# EAGLE design pCog104_Tester (EAGLE 6.6.0)

## Sheet 1 of 3
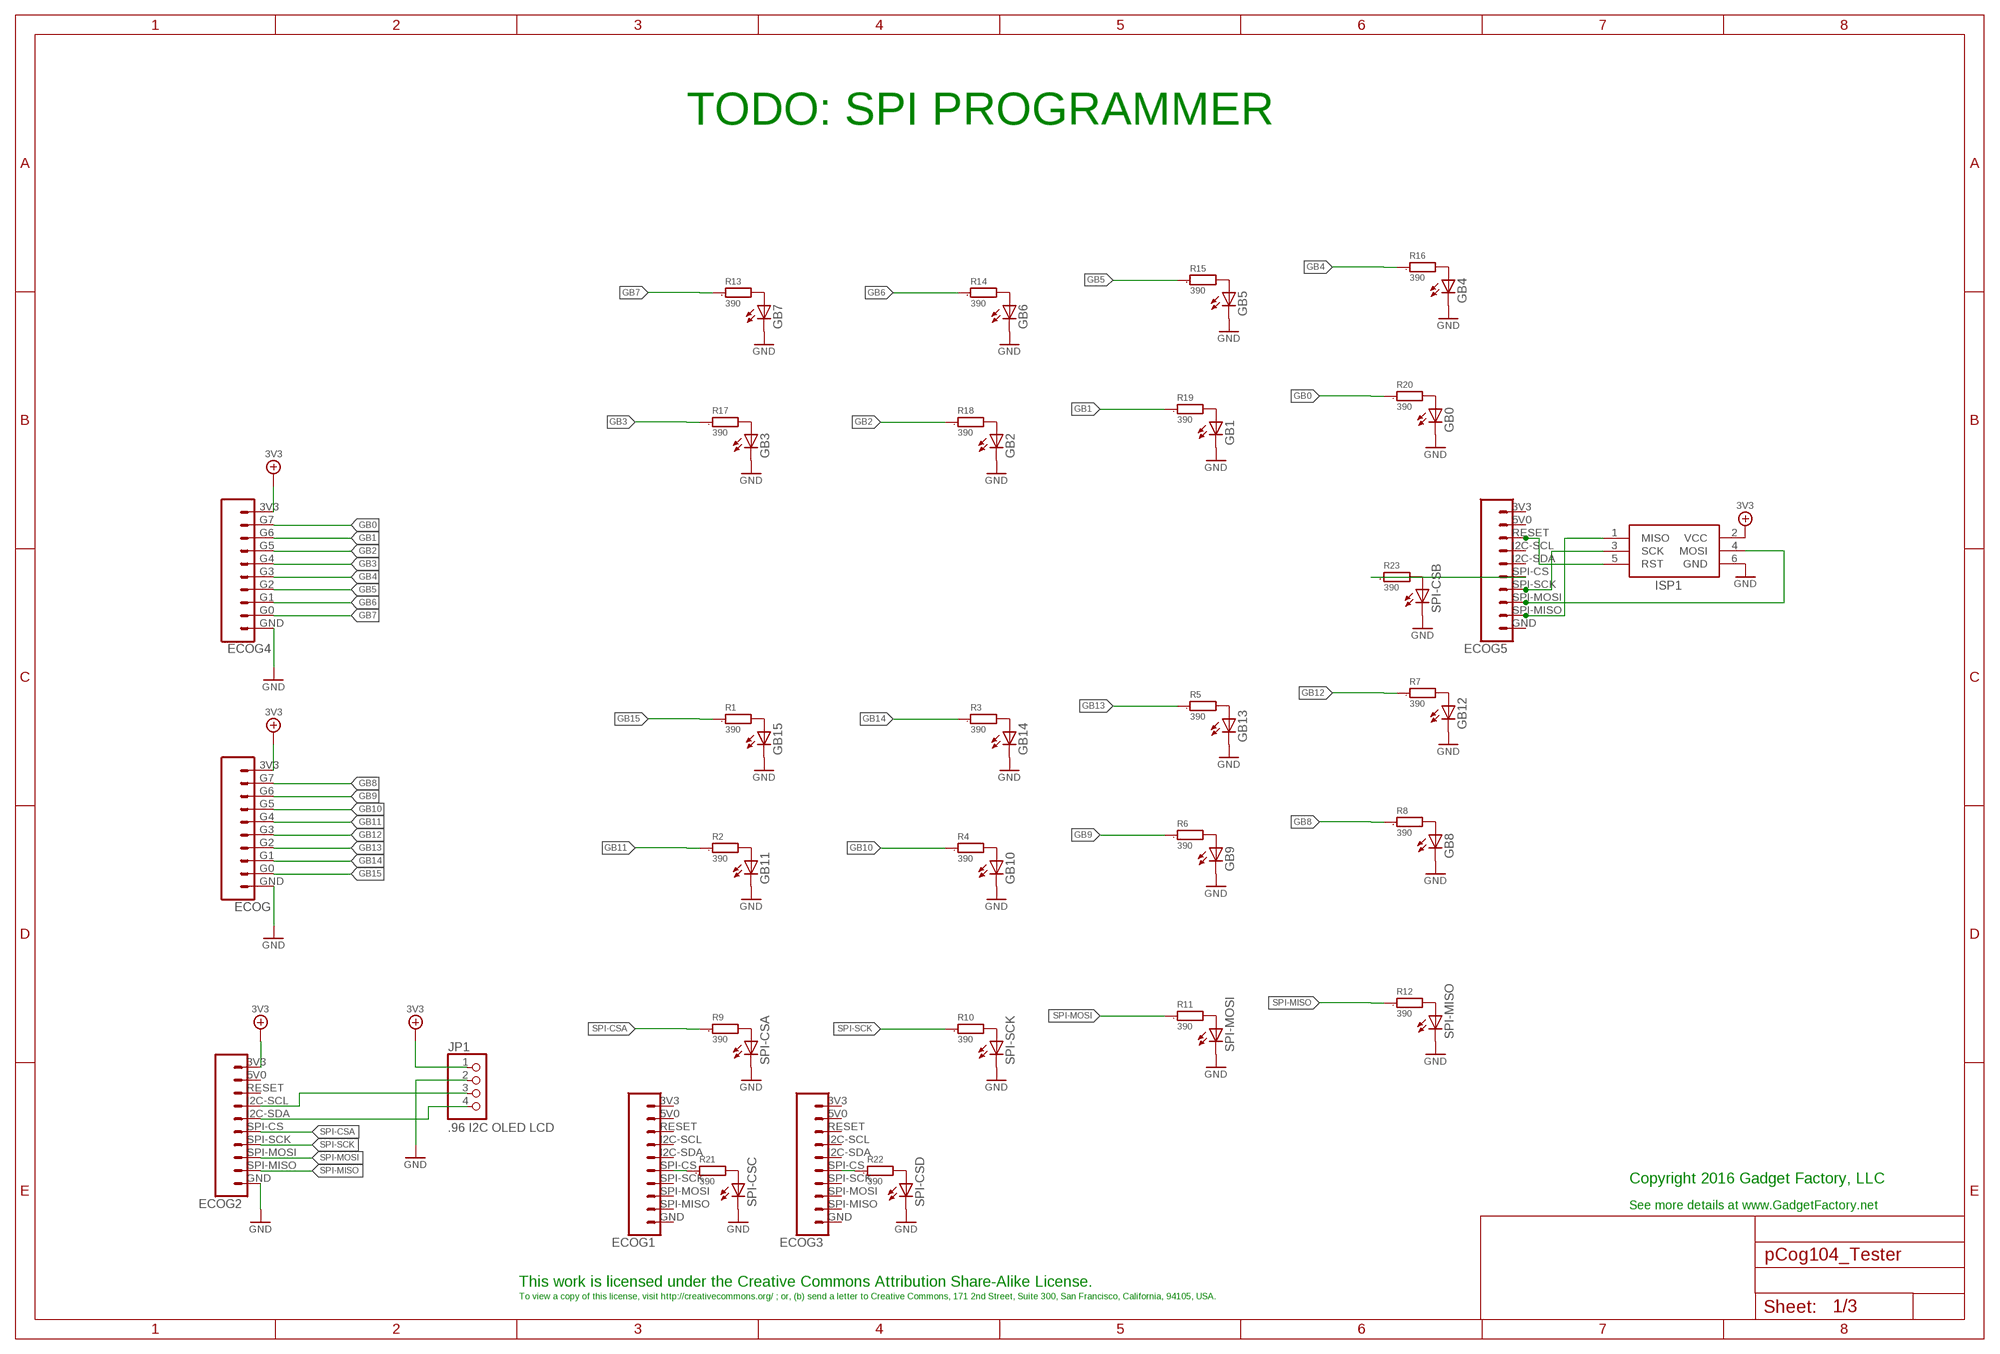
[diagram p0: schematic, sheet 1]

### Parts
ECOG  ECOG_GENERAL_ROWTHROUGHOLE  [ECOG_GENERAL_TH]
ECOG1  ECOG_BUSES_ROWTHROUGHHOLE  [ECOG_BUSES_TH]
ECOG2  ECOG_BUSES_ROWTHROUGHHOLE  [ECOG_BUSES_TH]
ECOG3  ECOG_BUSES_ROWTHROUGHHOLE  [ECOG_BUSES_TH]
ECOG4  ECOG_GENERAL_ROWTHROUGHOLE  [ECOG_GENERAL_TH]
ECOG5  ECOG_BUSES_ROWTHROUGHHOLE  [ECOG_BUSES_TH]
GB0  LEDCHIP-LED0805  [CHIP-LED0805]
GB1  LEDCHIP-LED0805  [CHIP-LED0805]
GB2  LEDCHIP-LED0805  [CHIP-LED0805]
GB3  LEDCHIP-LED0805  [CHIP-LED0805]
GB4  LEDCHIP-LED0805  [CHIP-LED0805]
GB5  LEDCHIP-LED0805  [CHIP-LED0805]
GB6  LEDCHIP-LED0805  [CHIP-LED0805]
GB7  LEDCHIP-LED0805  [CHIP-LED0805]
GB8  LEDCHIP-LED0805  [CHIP-LED0805]
GB9  LEDCHIP-LED0805  [CHIP-LED0805]
GB10  LEDCHIP-LED0805  [CHIP-LED0805]
GB11  LEDCHIP-LED0805  [CHIP-LED0805]
GB12  LEDCHIP-LED0805  [CHIP-LED0805]
GB13  LEDCHIP-LED0805  [CHIP-LED0805]
GB14  LEDCHIP-LED0805  [CHIP-LED0805]
GB15  LEDCHIP-LED0805  [CHIP-LED0805]
ISP1  AVRISP-6  [AVRISP]
JP1  .96 I2C OLED LCD  PINHD-1X4  [1X04]
R1  390  R0805  [0805]
R2  390  R0805  [0805]
R3  390  R0805  [0805]
R4  390  R0805  [0805]
R5  390  R0805  [0805]
R6  390  R0805  [0805]
R7  390  R0805  [0805]
R8  390  R0805  [0805]
R9  390  R0805  [0805]
R10  390  R0805  [0805]
R11  390  R0805  [0805]
R12  390  R0805  [0805]
R13  390  R0805  [0805]
R14  390  R0805  [0805]
R15  390  R0805  [0805]
R16  390  R0805  [0805]
R17  390  R0805  [0805]
R18  390  R0805  [0805]
R19  390  R0805  [0805]
R20  390  R0805  [0805]
R21  390  R0805  [0805]
R22  390  R0805  [0805]
R23  390  R0805  [0805]
SPI-CSA  LEDCHIP-LED0805  [CHIP-LED0805]
SPI-CSB  LEDCHIP-LED0805  [CHIP-LED0805]
SPI-CSC  LEDCHIP-LED0805  [CHIP-LED0805]
SPI-CSD  LEDCHIP-LED0805  [CHIP-LED0805]
SPI-MISO  LEDCHIP-LED0805  [CHIP-LED0805]
SPI-MOSI  LEDCHIP-LED0805  [CHIP-LED0805]
SPI-SCK  LEDCHIP-LED0805  [CHIP-LED0805]

### Nets
3V3: ECOG2.3V3 ECOG4.3V3 ECOG.3V3 ISP1.2(VCC) JP1.1
GB0: ECOG4.G7 R20.1
GB1: ECOG4.G6 R19.1
GB2: ECOG4.G5 R18.1
GB3: ECOG4.G4 R17.1
GB4: ECOG4.G3 R16.1
GB5: ECOG4.G2 R15.1
GB6: ECOG4.G1 R14.1
GB7: ECOG4.G0 R13.1
GB8: ECOG.G7 R8.1
GB9: ECOG.G6 R6.1
GB10: ECOG.G5 R4.1
GB11: ECOG.G4 R2.1
GB12: ECOG.G3 R7.1
GB13: ECOG.G2 R5.1
GB14: ECOG.G1 R3.1
GB15: ECOG.G0 R1.1
GND: ECOG2.GND ECOG4.GND ECOG.GND GB0.C GB1.C GB2.C GB3.C GB4.C GB5.C GB6.C GB7.C GB8.C GB9.C GB10.C GB11.C GB12.C GB13.C GB14.C GB15.C ISP1.6(GND) JP1.2 SPI-CSA.C SPI-CSB.C SPI-CSC.C SPI-CSD.C SPI-MISO.C SPI-MOSI.C SPI-SCK.C
N$1: GB15.A R1.2
N$2: GB14.A R3.2
N$3: GB13.A R5.2
N$4: GB12.A R7.2
N$5: R9.2 SPI-CSA.A
N$6: R10.2 SPI-SCK.A
N$7: ECOG2.I2C-SDA JP1.4
N$8: ECOG2.I2C-SCL JP1.3
N$9: R11.2 SPI-MOSI.A
N$10: R12.2 SPI-MISO.A
N$11: R21.2 SPI-CSC.A
N$12: GB11.A R2.2
N$13: GB10.A R4.2
N$14: GB9.A R6.2
N$15: GB8.A R8.2
N$16: GB7.A R13.2
N$17: GB6.A R14.2
N$18: GB5.A R15.2
N$19: GB4.A R16.2
N$20: GB3.A R17.2
N$21: GB2.A R18.2
N$22: GB1.A R19.2
N$23: GB0.A R20.2
N$24: R22.2 SPI-CSD.A
N$25: R23.2 SPI-CSB.A
N$26: ECOG1.SPI-CS R21.1
N$27: ECOG3.SPI-CS R22.1
N$28: ECOG5.SPI-CS R23.1
N$29: ECOG5.SPI-MISO ISP1.1(MISO)
N$30: ECOG5.SPI-SCK ISP1.3(SCK)
N$31: ECOG5.RESET(RSV) ISP1.5(RST)
N$32: ECOG5.SPI-MOSI ISP1.4(MOSI)
SPI-CSA: ECOG2.SPI-CS R9.1
SPI-MISO: ECOG2.SPI-MISO R12.1
SPI-MOSI: ECOG2.SPI-MOSI R11.1
SPI-SCK: ECOG2.SPI-SCK R10.1
Unconnected: ECOG1.3V3 ECOG1.5V0(RSV) ECOG1.GND ECOG1.I2C-SCL ECOG1.I2C-SDA ECOG1.RESET(RSV) ECOG1.SPI-MISO ECOG1.SPI-MOSI ECOG1.SPI-SCK ECOG2.5V0(RSV) ECOG2.RESET(RSV) ECOG3.3V3 ECOG3.5V0(RSV) ECOG3.GND ECOG3.I2C-SCL ECOG3.I2C-SDA ECOG3.RESET(RSV) ECOG3.SPI-MISO ECOG3.SPI-MOSI ECOG3.SPI-SCK ECOG5.3V3 ECOG5.5V0(RSV) ECOG5.GND ECOG5.I2C-SCL ECOG5.I2C-SDA

### Notes on the sheet
- TODO: SPI PROGRAMMER
- Copyright 2016 Gadget Factory, LLC
- See more details at www.GadgetFactory.net
- This work is licensed under the Creative Commons Attribution Share-Alike License.
- To view a copy of this license, visit http://creativecommons.org/ ; or, (b) send a letter to Creative Commons, 171 2nd Street, Suite 300, San Francisco, California, 94105, USA.

## Sheet 2 of 3
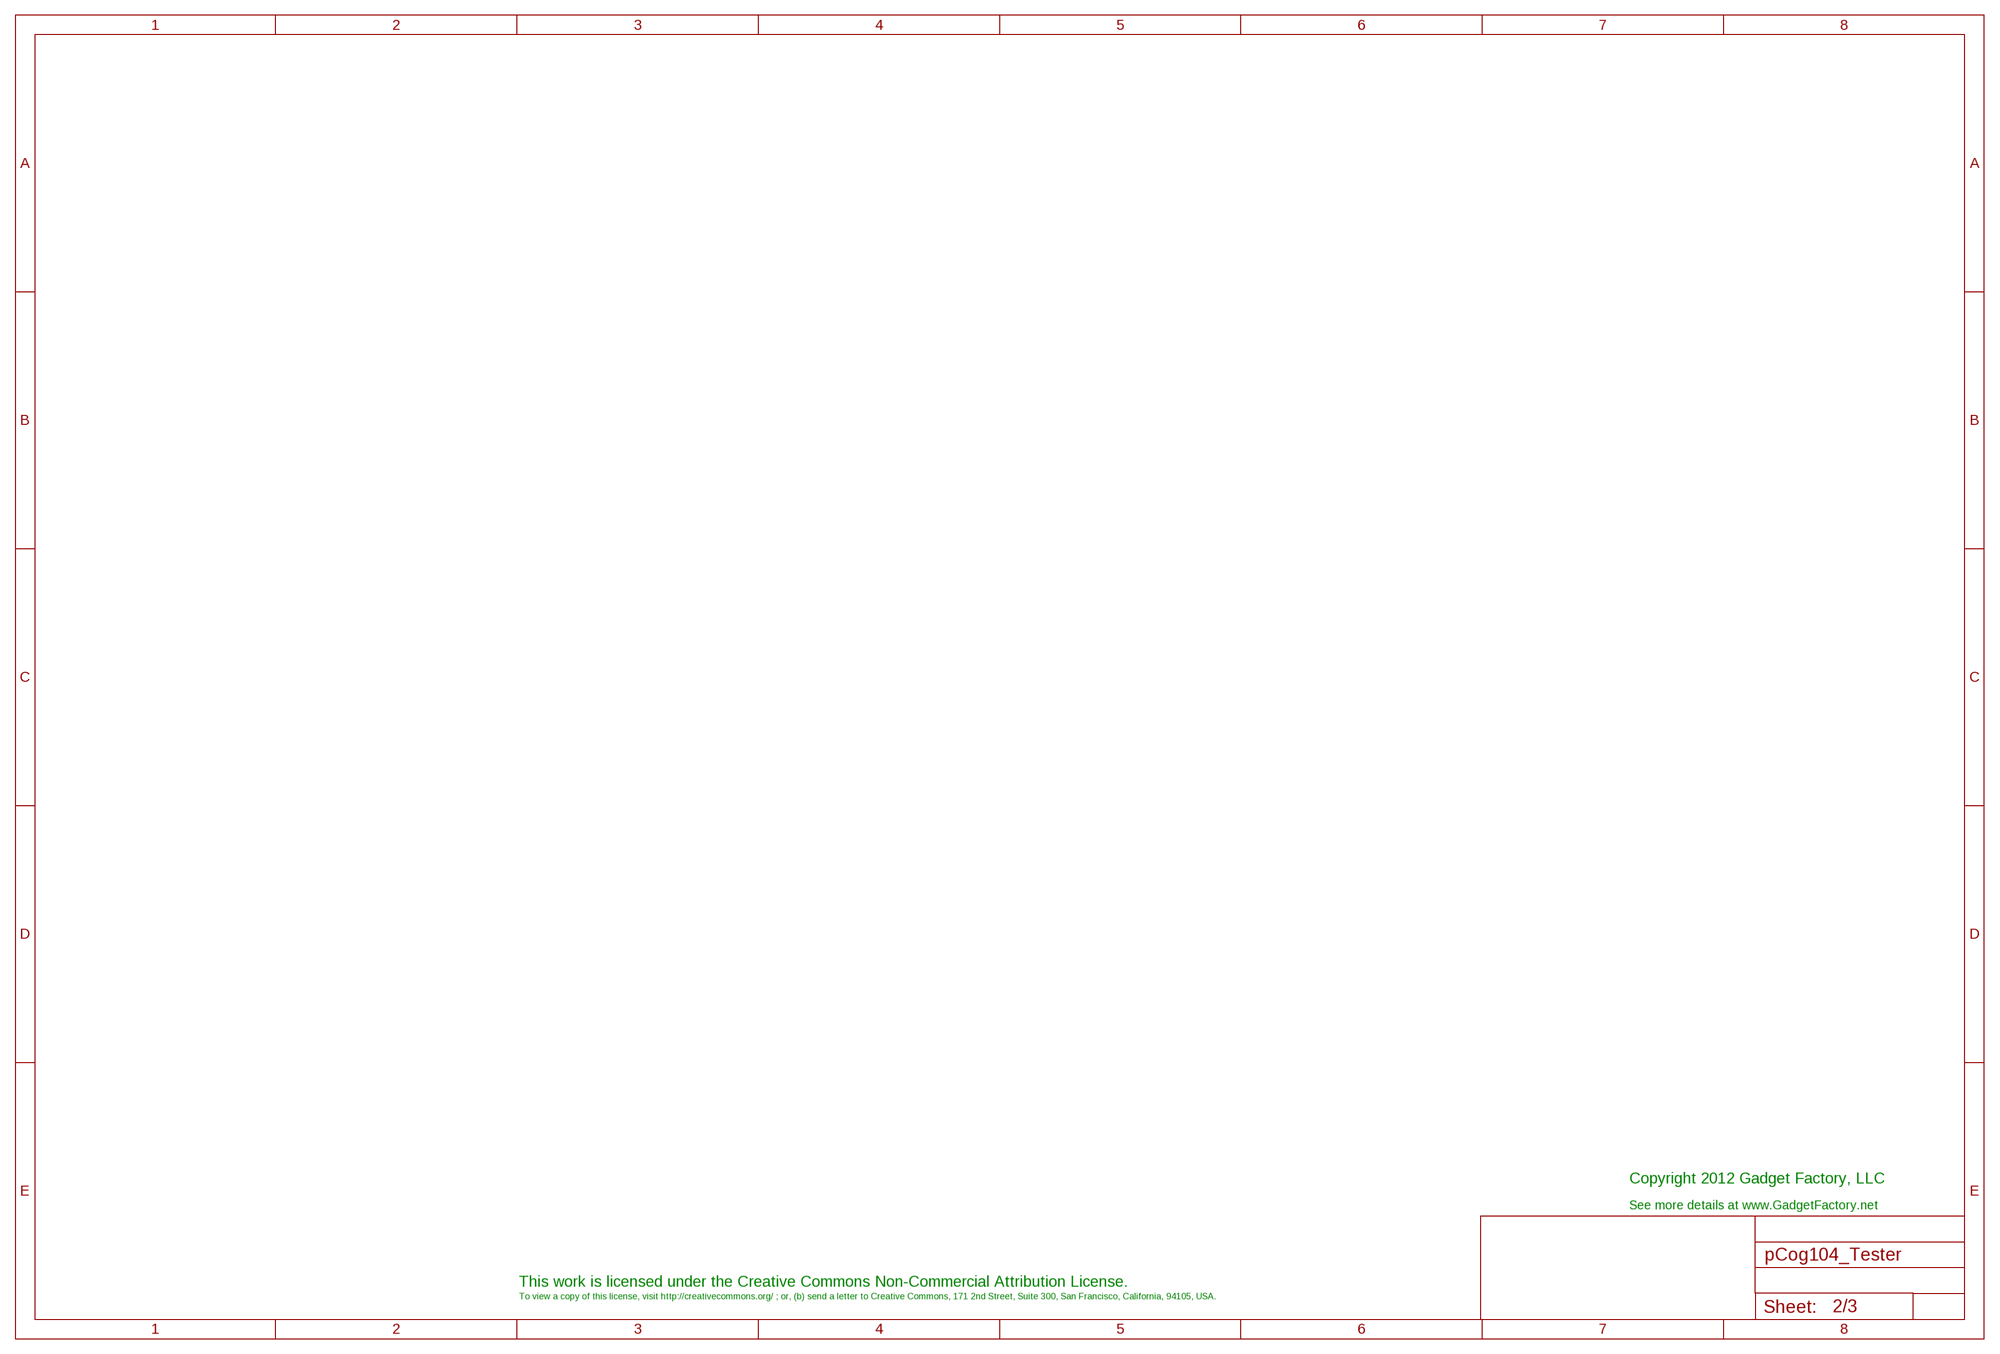
[diagram p1: schematic, sheet 2]

### Notes on the sheet
- Copyright 2012 Gadget Factory, LLC
- See more details at www.GadgetFactory.net
- This work is licensed under the Creative Commons Non-Commercial Attribution License.
- To view a copy of this license, visit http://creativecommons.org/ ; or, (b) send a letter to Creative Commons, 171 2nd Street, Suite 300, San Francisco, California, 94105, USA.

## Sheet 3 of 3
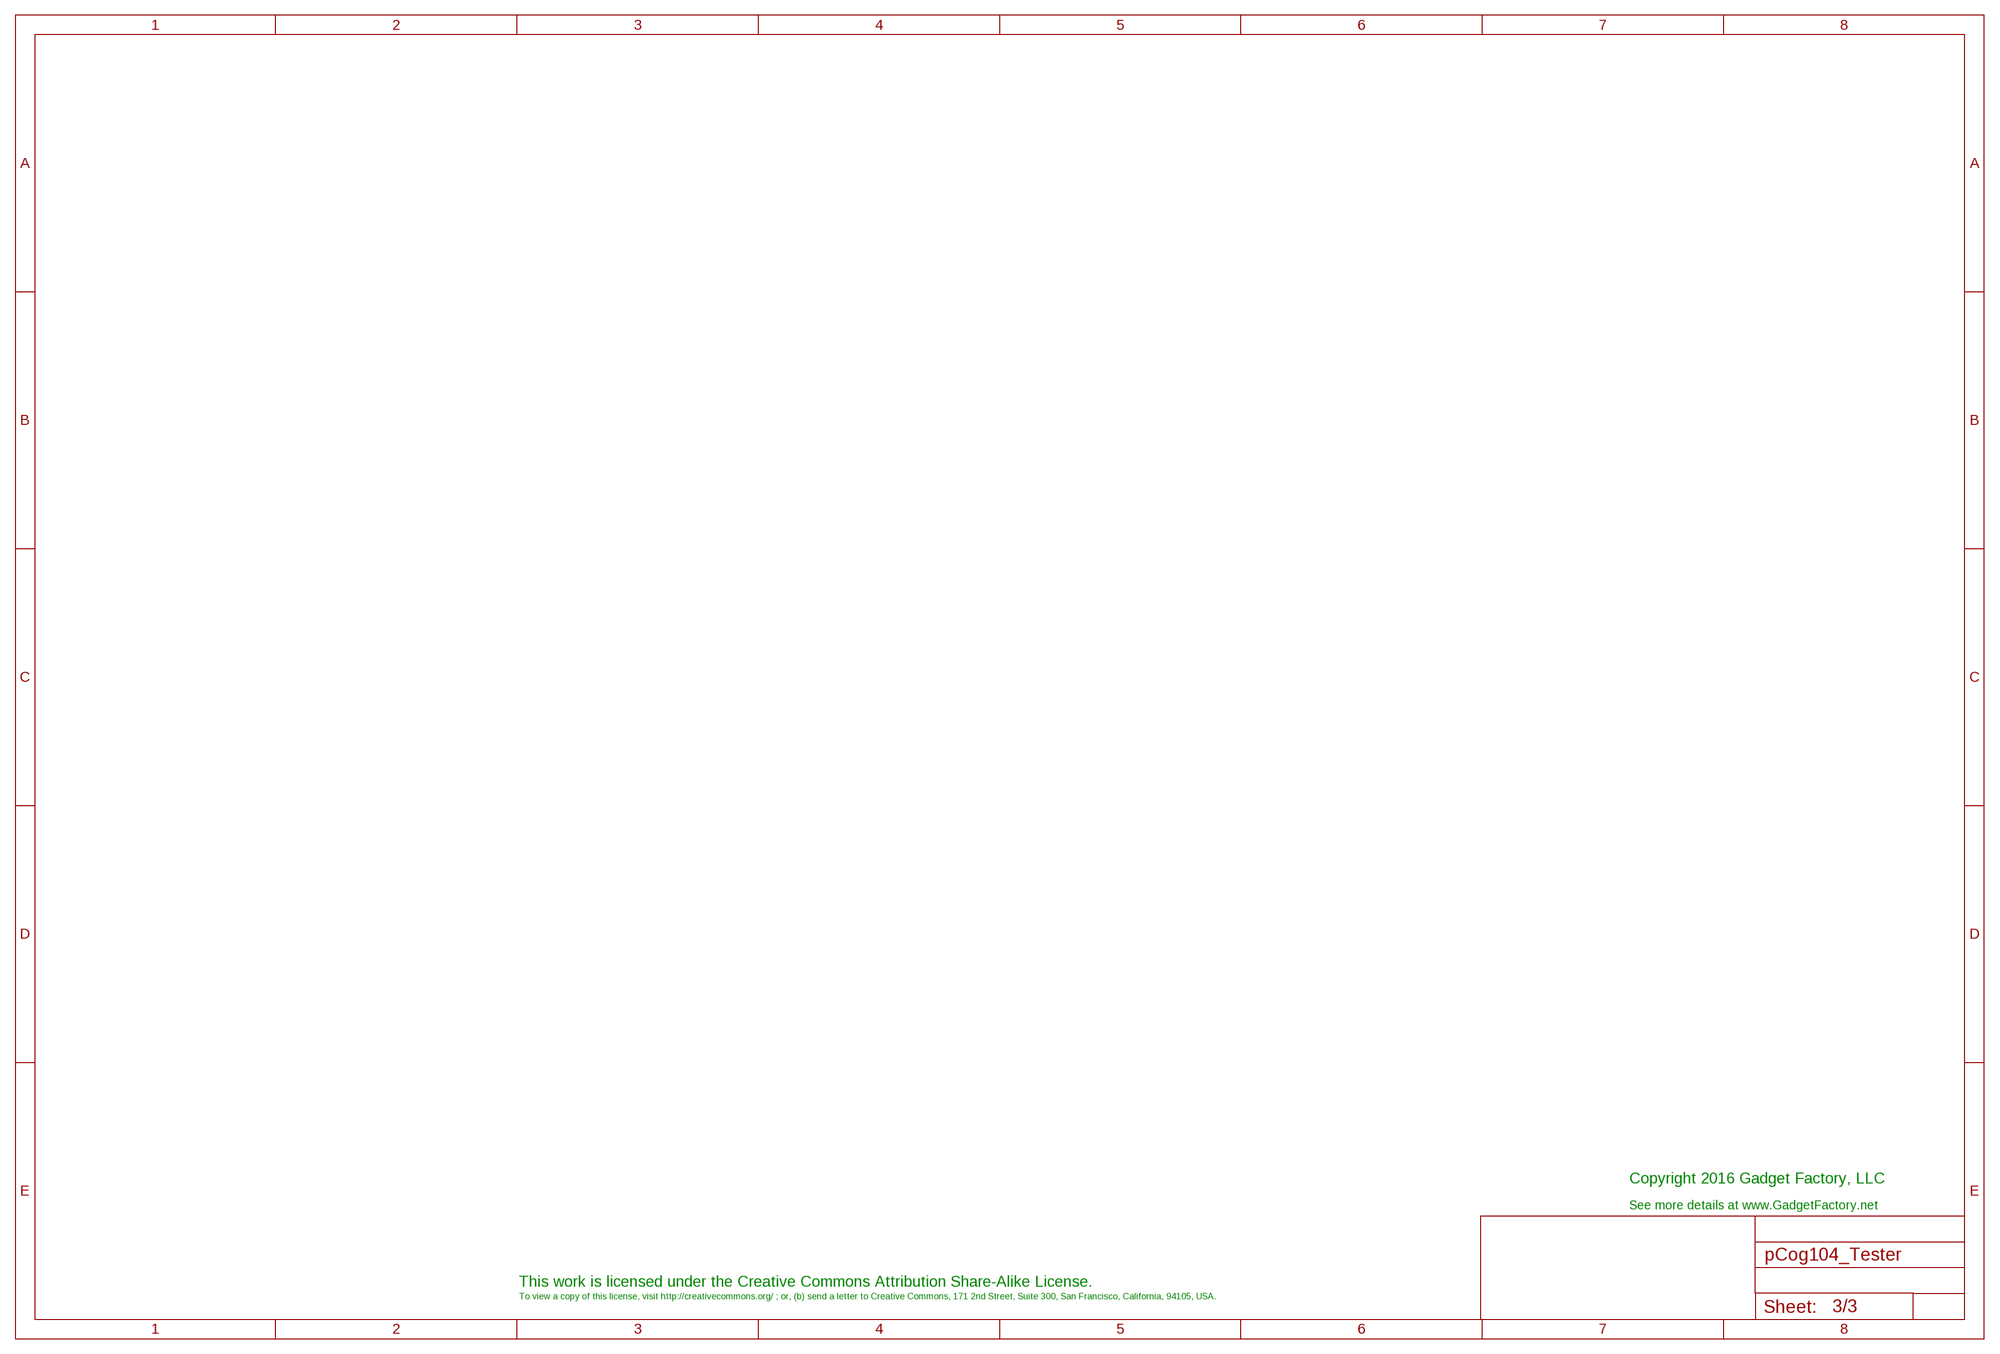
[diagram p2: schematic, sheet 3]

### Notes on the sheet
- Copyright 2016 Gadget Factory, LLC
- See more details at www.GadgetFactory.net
- This work is licensed under the Creative Commons Attribution Share-Alike License.
- To view a copy of this license, visit http://creativecommons.org/ ; or, (b) send a letter to Creative Commons, 171 2nd Street, Suite 300, San Francisco, California, 94105, USA.

## Library data of the parts
ECOG ECOG4 = eCogs:ECOG_GENERAL_ROW; PARTNO: NREC010SABC-M30RC,SULLINS CONNECTOR SOLUTIONS,dk,S1013EC-10-ND,10 Positions Header Unshrouded Connector 0.100 (2.54mm) Surface Mount Tin eCog, REF78
ECOG1-ECOG3 ECOG5 = eCogs:ECOG_BUSES_ROW; PARTNO: NREC010SABC-M30RC,SULLINS CONNECTOR SOLUTIONS,dk,S1013EC-10-ND,10 Positions Header Unshrouded Connector 0.100 (2.54mm) Surface Mount Tin eCog, REF78
GB0 GB1-GB15 SPI-CSA SPI-CSB SPI-CSC SPI-CSD SPI-MISO SPI-MOSI SPI-SCK = adafruit:LED: LED OSRAM: - CHIPLED LG R971, LG N971, LY N971, LG Q971, LY Q971, LO R971, LY R971 LH N974, LH R974 LS Q976, LO Q976, LY Q976 LO Q996 - Hyper CHIPLED LW Q18S LB Q993, LB Q99A, LB R99A - SideLED LS A670, LO A670, LY A670, LG A670, LP A670 LB A673, LV A673, LT A673, LW A673 LH A674 LY A675 LS A676, LA A676, LO A676, LY A676, LW A676 LS A679, LY A679, LG A679 - Hyper Micro SIDELED® LS Y876, LA Y876, LO Y876, LY Y876 LT Y87S - SmartLED LW L88C, LW L88S LB L89C, LB L89S, LG L890 LS L89K, LO L89K, LY L89K LS L896, LA L896, LO L896, LY L896 - TOPLED LS T670, LO T670, LY T670, LG T670, LP T670 LSG T670, LSP T670, LSY T670, LOP T670, LYG T670 LG T671, LOG T671, LSG T671 LB T673, LV T673, LT T673, LW T673 LH T674 LS T676, LA T676, LO T676, LY T676, LB T676, LH T676, LSB T676, LW T676 LB T67C, LV T67C, LT T67C, LS T67K, LO T67K, LY T67K, LW E67C LS E67B, LA E67B, LO E67B, LY E67B, LB E67C, LV E67C, LT E67C LW T67C LS T679, LY T679, LG T679 LS T770, LO T770, LY T770, LG T770, LP T770 LB T773, LV T773, LT T773, LW T773 LH T774 LS E675, LA E675, LY E675, LS T675 LS T776, LA T776, LO T776, LY T776, LB T776 LHGB T686 LT T68C, LB T68C - Hyper Mini TOPLED® LB M676 - Mini TOPLED Santana® LG M470 LS M47K, LO M47K, LY M47K Source: http://www.osram.convergy.de/; DIGIKEY: 475-1410-2-ND; PARTNO: LTST-C170KGKT,LITE-ON INC (VA),DK,160-1414-1-ND,LED GREEN CLEAR 0805 SMD, REF17
ISP1 = adafruit:AVRISP: AVR ISP HEADER Standard 6 pin header for AVR programming
JP1 = pinhead:PINHD-1X4: PIN HEADER; DEALEXTREME: 419232; PARTNO: 346540,unknown,dx.com,346540,"0.96"" 128*64 I2C Interface White Color OLED Display - http://www.dx.com/p/0-96-128x64-i2c-interface-white-color-oled-display-module-for-arduino-avr-arm-pic-346540", REF93
R1-R23 = GadgetFactory:R: RESISTOR, European symbol; DIGIKEY: RMCF0805JT390RCT-ND; PARTNO: MCR10EZPJ391,ROHM SEMICONDUCTOR (PASSIVE) (VA),DK,RHM390ARCT-ND,RES 390 OHM 1/8W 5% 0805 SMD, REF16

## Board
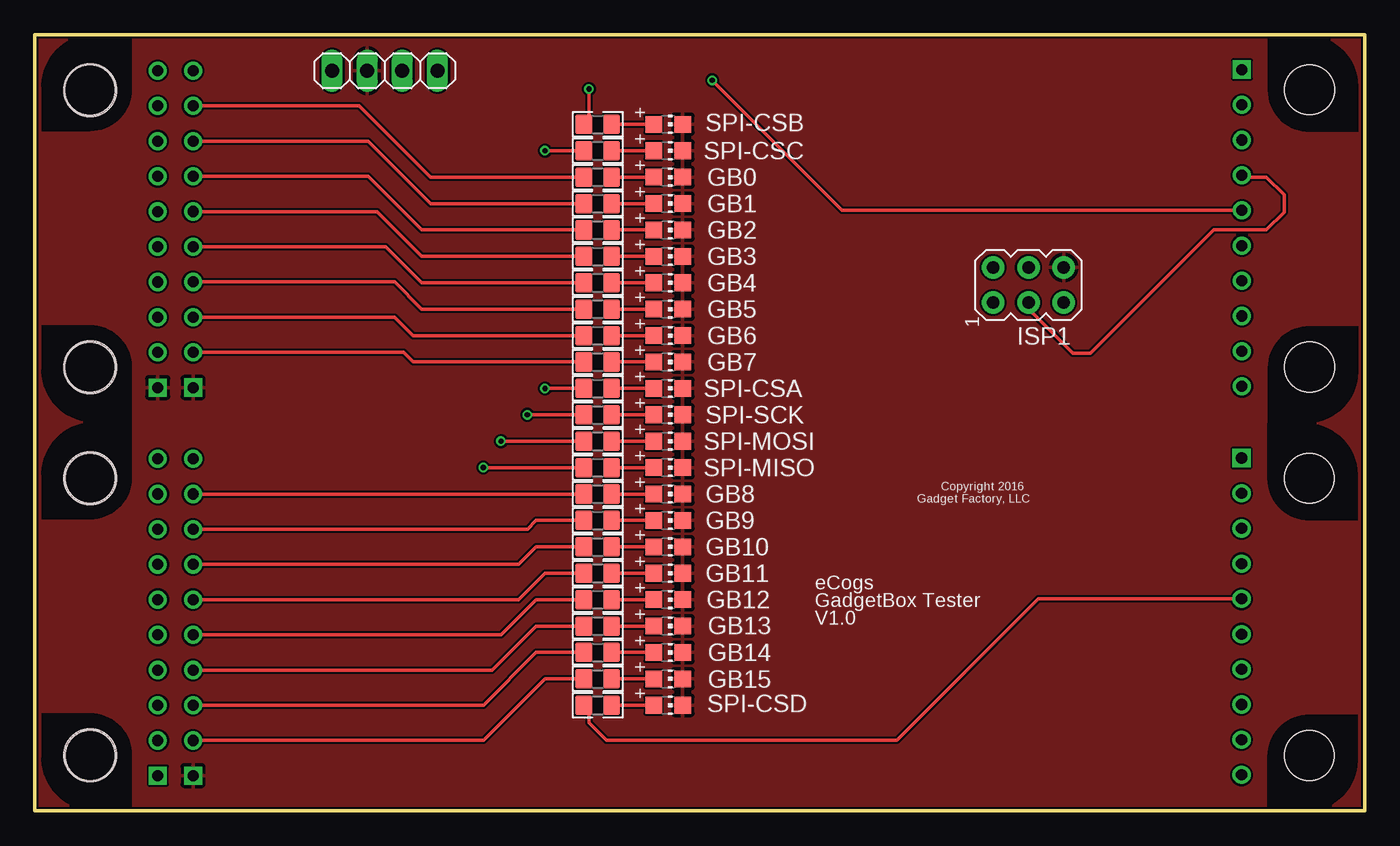
[diagram p3: board, top side]
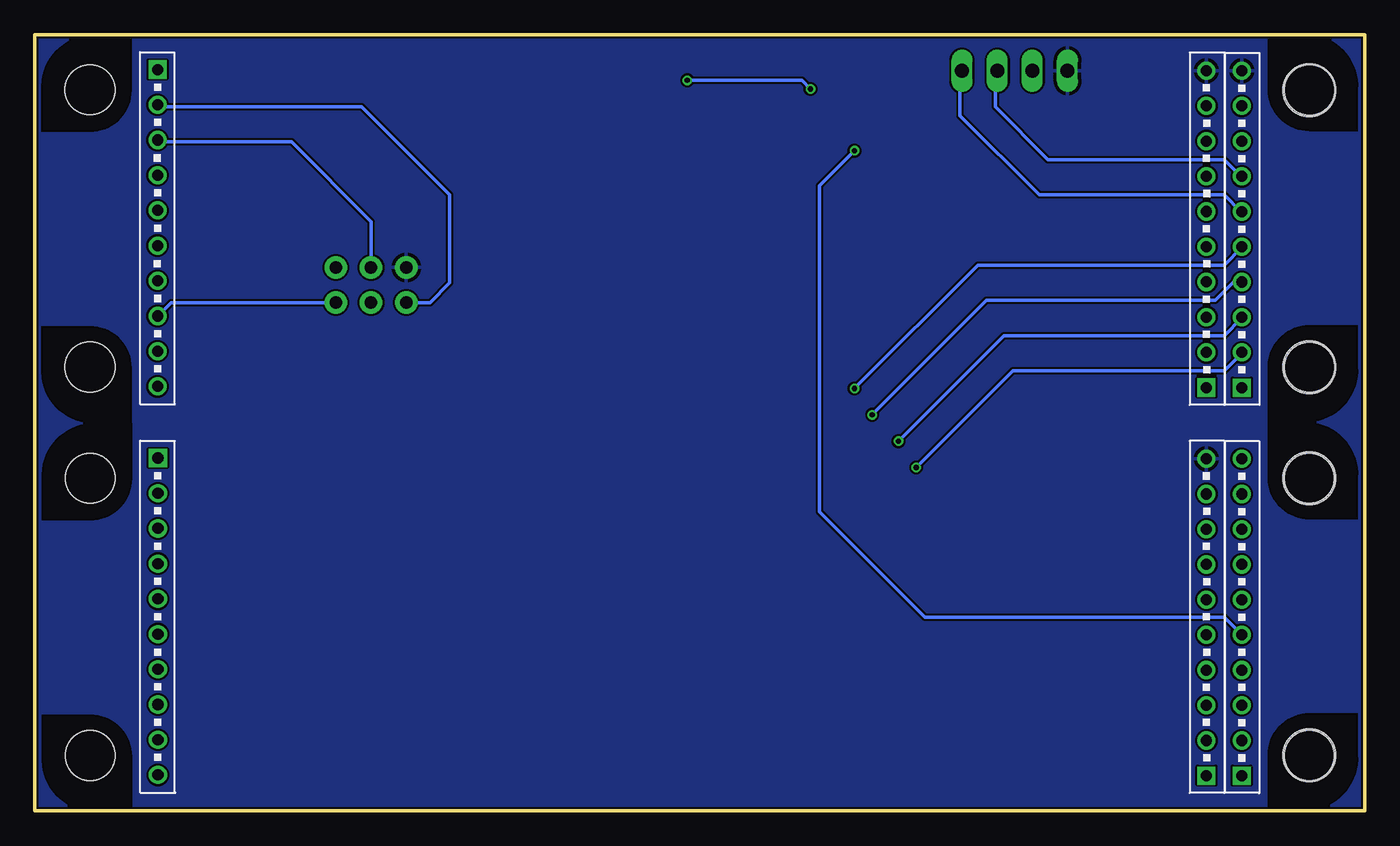
[diagram p4: board, bottom side, seen from below]

Size 96 x 56 mm. Coordinates in mm from the lower left corner, seen from the top.
Outline: 0,0 0,56 96,56 96,0 0,0
Copper layers (1*16): Top 0.035mm / dielectric 1.5mm / Bottom 0.035mm
Design rules "hackvana": minimum track width 6mil, minimum drill 0.3mm, track to track 6mil, track to pad 6mil, pad to pad 6mil, via to via 6mil, smd to smd 0mil, copper to edge 6mil, drill to drill 6mil, minimum pad ring 10mil, minimum via ring 6mil, stop-mask expansion 2mil, vias tented up to drill 100mil, thermal gap 10mil

### Footprints (pad centres in the part's own frame; a part is rotated, then mirrored left to right if it is on the bottom)
ECOG_GENERAL_TH = drill 0.8: 3V3 11.43,25.4; G0 11.43,5.08; G1 11.43,7.62; G2 11.43,10.16; G3 11.43,12.7; G4 11.43,15.24; G5 11.43,17.78; G6 11.43,20.32; G7 11.43,22.86 | drill 0.8 square: GND 11.43,2.54 | hole 3.8: 4,24; 4,4
ECOG_BUSES_TH = drill 0.8: 3V3 8.89,25.4; 5V0 8.89,22.86; I2C-SCL 8.89,17.78; I2C-SDA 8.89,15.24; RESET 8.89,20.32; SPI-CS 8.89,12.7; SPI-MISO 8.89,5.08; SPI-MOSI 8.89,7.62; SPI-SCK 8.89,10.16 | drill 0.8 square: GND 8.89,2.54 | hole 3.6: 4.004,24.003; 4.004,4.003
CHIP-LED0805 = smd 1.2 x 1.2: A 0,-1.05; C 0,1.05
AVRISP = drill 0.9 pad 1.626: 1 -1.27,2.54; 2 1.27,2.54; 3 -1.27,0; 4 1.27,0; 5 -1.27,-2.54; 6 1.27,-2.54
1X04 = drill 1.016 long: 1 -3.81,0; 2 -1.27,0; 3 1.27,0; 4 3.81,0
0805 = smd 1.2 x 1.4: 1 -1,0; 2 1,0

### Placement (x,y rotation side)
ECOG  0,0 0 top
ECOG1  0,0 0 top
ECOG2  -0.01,28 0 top
ECOG3  95.99,28 180 top
ECOG4  0,28 0 top
ECOG5  96.02,56.02 180 top
GB0  45.72,45.72 270 top
GB1  45.72,43.81 270 top
GB2  45.72,41.91 270 top
GB3  45.72,40.01 270 top
GB4  45.72,38.1 270 top
GB5  45.72,36.2 270 top
GB6  45.72,34.29 270 top
GB7  45.72,32.38 270 top
GB8  45.72,22.86 270 top
GB9  45.72,20.95 270 top
GB10  45.72,19.05 270 top
GB11  45.72,17.14 270 top
GB12  45.72,15.24 270 top
GB13  45.72,13.34 270 top
GB14  45.72,11.43 270 top
GB15  45.72,9.53 270 top
ISP1  71.72,37.94 90 top
JP1  25.26,53.4 0 top
R1  40.64,9.53 0 top
R2  40.64,17.14 0 top
R3  40.64,11.43 0 top
R4  40.64,19.05 0 top
R5  40.64,13.34 0 top
R6  40.64,20.95 0 top
R7  40.64,15.24 0 top
R8  40.64,22.86 0 top
R9  40.64,30.48 0 top
R10  40.64,28.57 0 top
R11  40.64,26.67 0 top
R12  40.64,24.77 0 top
R13  40.64,32.38 0 top
R14  40.64,34.29 0 top
R15  40.64,36.2 0 top
R16  40.64,38.1 0 top
R17  40.64,40.01 0 top
R18  40.64,41.91 0 top
R19  40.64,43.81 0 top
R20  40.64,45.72 0 top
R21  40.64,47.62 0 top
R22  40.64,7.62 0 top
R23  40.64,49.53 0 top
SPI-CSA  45.72,30.48 270 top
SPI-CSB  45.72,49.53 270 top
SPI-CSC  45.72,47.62 270 top
SPI-CSD  45.72,7.62 270 top
SPI-MISO  45.72,24.77 270 top
SPI-MOSI  45.72,26.67 270 top
SPI-SCK  45.72,28.57 270 top

### Tracks (layer width: path | path; a pad name or v marks a point on that pad's centre or on a via)
3V3
  pour Bottom: -1.91,57.78 -1.91,-1.91 98.42,-1.91 98.42,57.78
GB0
  Top 0.254: ECOG4.G7 23.43,50.86 28.57,45.72 R20.1
GB1
  Top 0.254: ECOG4.G6 24.07,48.32 28.57,43.81 R19.1
GB2
  Top 0.254: ECOG4.G5 24.07,45.78 27.94,41.91 R18.1
GB3
  Top 0.254: ECOG4.G4 24.7,43.24 27.94,40.01 R17.1
GB4
  Top 0.254: ECOG4.G3 25.34,40.7 27.94,38.1 R16.1
GB5
  Top 0.254: ECOG4.G2 25.98,38.16 27.94,36.2 R15.1
GB6
  Top 0.254: ECOG4.G1 25.98,35.62 27.3,34.29 R14.1
GB7
  Top 0.254: ECOG4.G0 26.61,33.08 27.3,32.38 R13.1
GB8
  Top 0.254: R8.1 ECOG.G7
GB9
  Top 0.254: ECOG.G6 35.56,20.32 36.2,20.95 R6.1
GB10
  Top 0.254: ECOG.G5 34.92,17.78 36.2,19.05 R4.1
GB11
  Top 0.254: ECOG.G4 34.92,15.24 36.83,17.14 R2.1
GB12
  Top 0.254: ECOG.G3 33.66,12.7 36.2,15.24 R7.1
GB13
  Top 0.254: ECOG.G2 33.02,10.16 36.2,13.34 R5.1
GB14
  Top 0.254: ECOG.G1 32.38,7.62 36.2,11.43 R3.1
GB15
  Top 0.254: ECOG.G0 32.38,5.08 36.83,9.53 R1.1
GND
  pour Top: -1.27,57.15 97.79,57.15 97.79,-1.27 -1.27,-1.27 -1.27,1.27
N$1
  Top 0.254: GB15.A R1.2
N$2
  Top 0.254: R3.2 GB14.A
N$3
  Top 0.254: R5.2 GB13.A
N$4
  Top 0.254: R7.2 GB12.A
N$5
  Top 0.254: R9.2 SPI-CSA.A
N$6
  Top 0.254: R10.2 SPI-SCK.A
N$7
  Bottom 0.254: ECOG2.I2C-SDA 8.95,43.24 10.16,44.45 23.5,44.45 29.21,50.16 29.21,53.26 JP1.4
N$8
  Bottom 0.254: ECOG2.I2C-SCL 8.95,45.78 10.16,46.99 22.86,46.99 26.67,50.8 26.67,53.26 JP1.3
N$9
  Top 0.254: R11.2 SPI-MOSI.A
N$10
  Top 0.254: R12.2 SPI-MISO.A
N$11
  Top 0.254: R21.2 SPI-CSC.A
N$12
  Top 0.254: R2.2 GB11.A
N$13
  Top 0.254: R4.2 GB10.A
N$14
  Top 0.254: R6.2 GB9.A
N$15
  Top 0.254: R8.2 GB8.A
N$16
  Top 0.254: R13.2 GB7.A
N$17
  Top 0.254: R14.2 GB6.A
N$18
  Top 0.254: R15.2 GB5.A
N$19
  Top 0.254: R16.2 GB4.A
N$20
  Top 0.254: R17.2 GB3.A
N$21
  Top 0.254: R18.2 GB2.A
N$22
  Top 0.254: R19.2 GB1.A
N$23
  Top 0.254: R20.2 GB0.A
N$24
  Top 0.254: R22.2 SPI-CSD.A
N$25
  Top 0.254: R23.2 SPI-CSB.A
N$26  (via drill 0.38)
  Top 0.254: v36.83,47.62 R21.1
  Bottom 0.254: ECOG1.SPI-CS 10.16,13.97 31.75,13.97 39.37,21.59 39.37,45.09 v36.83,47.62
N$27
  Top 0.254: ECOG3.SPI-CS 72.45,15.3 62.23,5.08 41.27,5.08 40.01,6.35 40.01,7.25 R22.1
N$28  (via drill 0.38)
  Top 0.254: ECOG5.SPI-CS 58.28,43.32 v48.9,52.7 | 39.37,49.8 R23.1 40.01,49.9 v40.01,52.07
  Bottom 0.254: v48.9,52.7 40.64,52.7 v40.01,52.07
N$29
  Bottom 0.254: ISP1.1 67.47,36.67 66.04,38.1 66.04,44.45 72.39,50.8 86.99,50.8 ECOG5.SPI-MISO
N$30
  Top 0.254: ISP1.3 71.72,36.23 74.93,33.02 76.2,33.02 85.09,41.91 88.9,41.91 90.17,43.18 90.17,44.45 88.9,45.72 87.27,45.72 ECOG5.SPI-SCK
N$31
  Bottom 0.254: ISP1.5 86.16,36.67 ECOG5.RESET
N$32
  Bottom 0.254: ISP1.4 71.72,42.51 77.47,48.26 86.99,48.26 ECOG5.SPI-MOSI
SPI-CSA  (via drill 0.38)
  Top 0.254: v36.83,30.48 R9.1
  Bottom 0.254: ECOG2.SPI-CS 8.88,40.65 10.16,39.37 27.94,39.37 v36.83,30.48
SPI-MISO  (via drill 0.38)
  Top 0.254: v32.38,24.77 R12.1
  Bottom 0.254: ECOG2.SPI-MISO 8.88,33.03 10.16,31.75 25.4,31.75 v32.38,24.77
SPI-MOSI  (via drill 0.38)
  Top 0.254: v33.66,26.67 R11.1
  Bottom 0.254: ECOG2.SPI-MOSI 8.88,35.57 10.16,34.29 26.04,34.29 v33.66,26.67
SPI-SCK  (via drill 0.38)
  Top 0.254: v35.56,28.57 R10.1
  Bottom 0.254: ECOG2.SPI-SCK 9.47,38.16 10.79,36.83 27.3,36.83 v35.56,28.57

### Text on the board
tPlace: Copyright 2016 | Gadget Factory, LLC | eCogs | GadgetBox Tester | V1.0